# EAGLE design Power Supply (EAGLE 9.6.2)
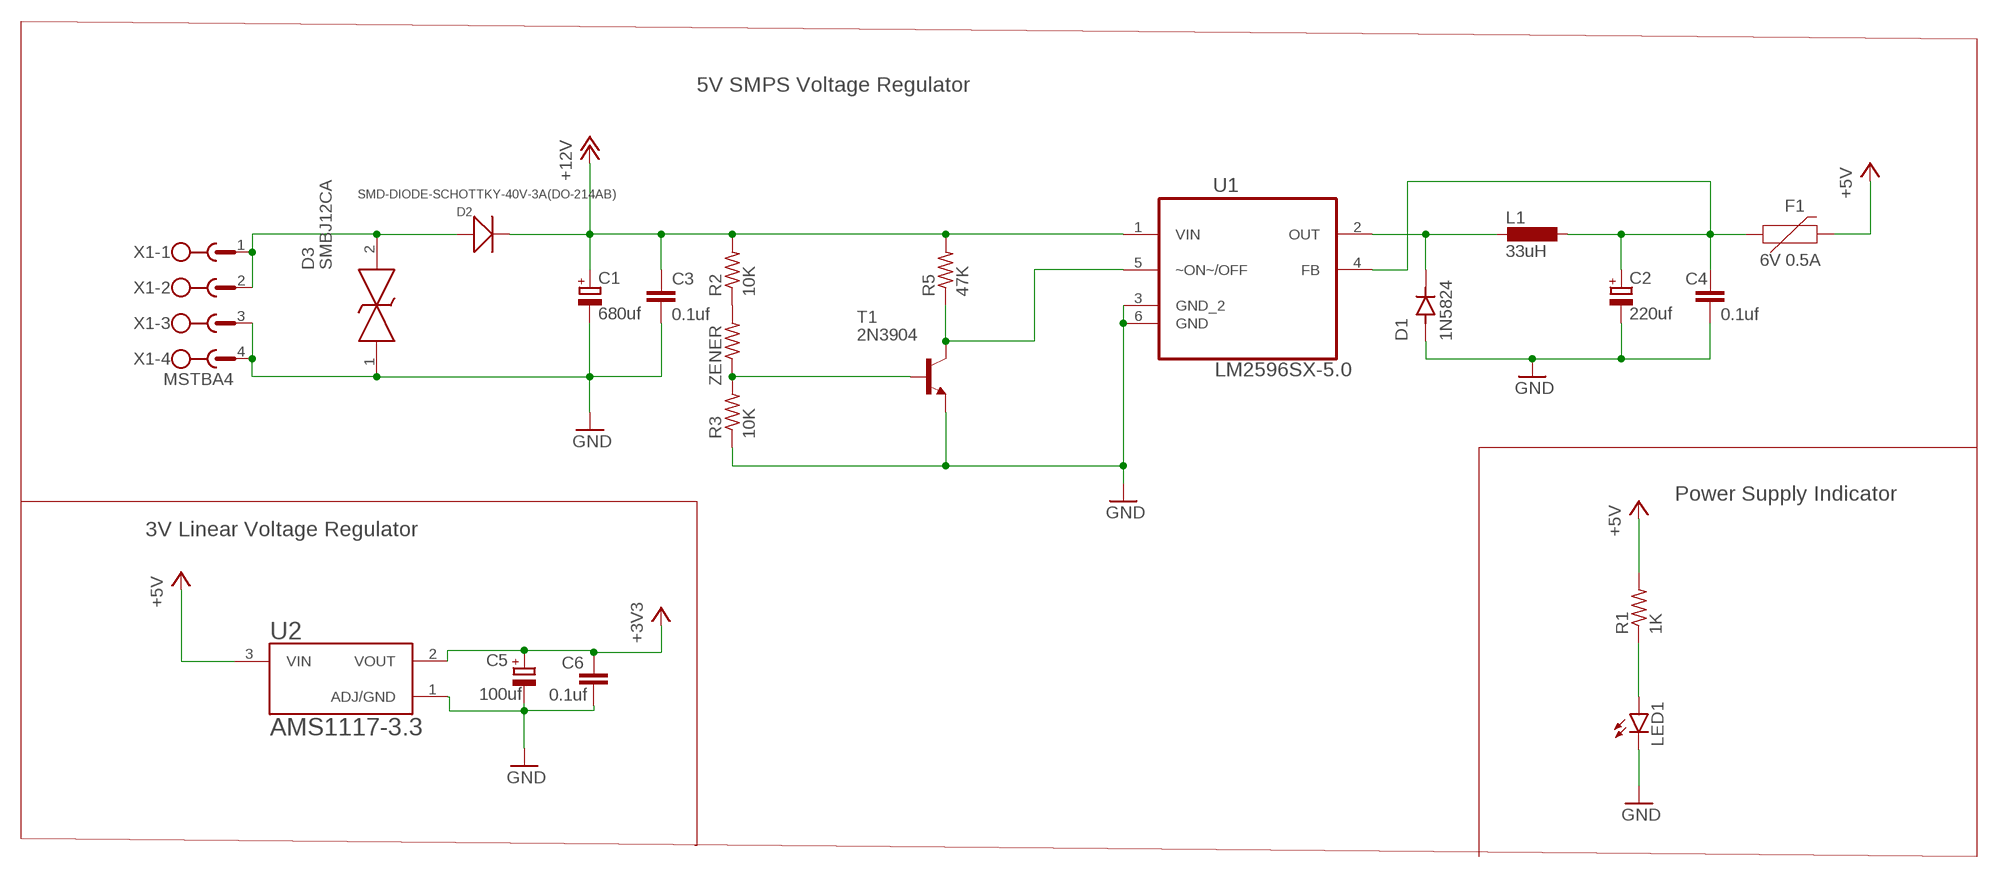
[diagram p0: schematic, sheet 1]

## Parts
C1  680uf  CPOL-EUSMCB  [SMC_B]
C2  220uf  CPOL-EUSMCB  [SMC_B]
C3  0.1uf  C-EUC0805  [C0805]
C4  0.1uf  C-EUC0805  [C0805]
C5  100uf  CPOL-EUSMCB  [SMC_B]
C6  0.1uf  C-EUC0805  [C0805]
D1  1N5824  [DIOAD1898W129L762D1143]
D2  SMD-DIODE-SCHOTTKY-40V-3A(DO-214AB)  [DO-214AB]
D3  SMBJ12CA  [DIONM5443X244N]
F1  6V 0.5A  PPTC_6V500MA  [0805]
L1  33uH  L-EUL1812  [L1812]
LED1  LED3MM  [LED3MM]
R1  1K  R-US_R0805  [R0805]
R2  10K  R-US_R0805  [R0805]
R3  10K  R-US_R0805  [R0805]
R5  47K  R-US_0204/7  [0204/7]
T1  2N3904  [TO92]
U1  LM2596SX-5.0  [TO170P1435X465-6N]
U2  AMS1117-3.3  [SOT229P700X180-4N]
X1  MSTBA4  [MSTBA4]
ZENER  R-US_0204/7  [0204/7]

## Nets
+3V3: C5.+ C6.1 U2.2(VOUT)
+5V: F1.2 R1.2 U2.3(VIN)
+12V: C1.+ C3.1 D2.2(-) R2.2 R5.2 U1.1(VIN)
GND: C1.- C2.- C3.2 C4.2 C5.- C6.2 D1.A D3.1 LED1.K(C) R3.1 T1.3(E) U1.3(GND_2) U1.6(GND) U2.1(ADJ/GND) X1.3 X1.4
N$1: D1.C(K) L1.2 U1.2(OUT)
N$2: LED1.A R1.1
N$3: D2.1(+) D3.2 X1.1 X1.2
N$4: R2.1 ZENER.2
N$5: R3.2 T1.2(B) ZENER.1
N$6: R5.1 T1.1(C) U1.5(~ON~/OFF)
N$7: C2.+ C4.1 F1.1 L1.1 U1.4(FB)

## Notes on the sheet
- 5V SMPS Voltage Regulator
- Power Supply Indicator
- 3V Linear Voltage Regulator

## Library data of the parts
C1 C2 C5 = rcl:CPOL-EU: POLARIZED CAPACITOR, European symbol; SPICEPREFIX: C
C3 C4 C6 = rcl:C-EU: CAPACITOR, European symbol; SPICEPREFIX: C
D1 = 1N5824:1N5824: 1N5824 Check prices <https://pricing.snapeda.com/parts/1N5824/Microchip%20Technology/view-part?ref=eda>; AVAILABILITY: Bad; DESCRIPTION: Diode Schottky 30V 5A Through Hole Axial; MF: Microchip Technology; MP: 1N5824; PACKAGE: None; PRICE: None
D2 = PC_Diode_SS34:SMD-DIODE-SCHOTTKY-40V-3A(DO-214AB): 304020018; AVAILABILITY: Unavailable; DESCRIPTION: Rectifier, Schottky; DO-214AB; 3.0A IF; 0.75V; 40V; 100A IFRM; 10000V/us; 1000pF; MF: Vishay; MP: SS34-E3/57T; PACKAGE: DO-214 Vishay; PRICE: None
D3 = PC_Diode_SMBJ12CA:SMBJ12CA: BOURNS - SMBJ12CA - TVS DIODE, 600W, 12V, BIDIR, DO-214AA Source: Datasheet <https://www.mouser.com/ds/2/54/mbj-778392.pdf>; DESCRIPTION: BOURNS - SMBJ12CA - TVS DIODE, 600W, 12V, BIDIR, DO-214AA; HEIGHT: 2.44mm; MANUFACTURER_NAME: Bourns; MANUFACTURER_PART_NUMBER: SMBJ12CA; MOUSER_PART_NUMBER: 652-SMBJ12CA; MOUSER_PRICE-STOCK: https://www.mouser.com/Search/Refine.aspx?Keyword=652-SMBJ12CA
F1 = SparkFun-Fuses:PPTC: Resettable Fuse PPTC Resettable Fuse. Really a sort of resistor with a polymeric positive temperature coefficient whose resistance increases dramatically with an increase in temperature. When heated by the power passing through the resistance rises causing the current to be limited, protecting the circuit. This is achieved by the transition of the polymer from a crystalline to an amorphous state where the conductive carbon separates breaking the conductive pathways found in the cool crystalline structure. When a PPTC cools back down it resumes conducting letting the circuit turn back on. SparkFun Products: SparkFun RedBoard - Programmed with Arduino <https://www.sparkfun.com/products/12757> Pro Micro - 5V/16MHz <https://www.sparkfun.com/products/12640> Arduino Pro 328 - 5V/16MHz <https://www.sparkfun.com/products/10915> MP3 Trigger <https://www.sparkfun.com/products/13720>; PROD_ID: RES-13945
L1 = rcl:L-EU: INDUCTOR, European symbol; SPICEPREFIX: L
LED1 = led:LED: LED OSRAM: - CHIPLED LG R971, LG N971, LY N971, LG Q971, LY Q971, LO R971, LY R971 LH N974, LH R974 LS Q976, LO Q976, LY Q976 LO Q996 - Hyper CHIPLED LW Q18S LB Q993, LB Q99A, LB R99A - SideLED LS A670, LO A670, LY A670, LG A670, LP A670 LB A673, LV A673, LT A673, LW A673 LH A674 LY A675 LS A676, LA A676, LO A676, LY A676, LW A676 LS A679, LY A679, LG A679 - Hyper Micro SIDELED® LS Y876, LA Y876, LO Y876, LY Y876 LT Y87S - SmartLED LW L88C, LW L88S LB L89C, LB L89S, LG L890 LS L89K, LO L89K, LY L89K LS L896, LA L896, LO L896, LY L896 - TOPLED LS T670, LO T670, LY T670, LG T670, LP T670 LSG T670, LSP T670, LSY T670, LOP T670, LYG T670 LG T671, LOG T671, LSG T671 LB T673, LV T673, LT T673, LW T673 LH T674 LS T676, LA T676, LO T676, LY T676, LB T676, LH T676, LSB T676, LW T676 LB T67C, LV T67C, LT T67C, LS T67K, LO T67K, LY T67K, LW E67C LS E67B, LA E67B, LO E67B, LY E67B, LB E67C, LV E67C, LT E67C LW T67C LS T679, LY T679, LG T679 LS T770, LO T770, LY T770, LG T770, LP T770 LB T773, LV T773, LT T773, LW T773 LH T774 LS E675, LA E675, LY E675, LS T675 LS T776, LA T776, LO T776, LY T776, LB T776 LHGB T686 LT T68C, LB T68C - Hyper Mini TOPLED® LB M676 - Mini TOPLED Santana® LG M470 LS M47K, LO M47K, LY M47K Source: http://www.osram.convergy.de LUXEON: - LUMILED® LXK2-PW12-R00, LXK2-PW12-S00, LXK2-PW14-U00, LXK2-PW14-V00 LXK2-PM12-R00, LXK2-PM12-S00, LXK2-PM14-U00 LXK2-PE12-Q00, LXK2-PE12-R00, LXK2-PE12-S00, LXK2-PE14-T00, LXK2-PE14-U00 LXK2-PB12-K00, LXK2-PB12-L00, LXK2-PB12-M00, LXK2-PB14-N00, LXK2-PB14-P00, LXK2-PB14-Q00 LXK2-PR12-L00, LXK2-PR12-M00, LXK2-PR14-Q00, LXK2-PR14-R00 LXK2-PD12-Q00, LXK2-PD12-R00, LXK2-PD12-S00 LXK2-PH12-R00, LXK2-PH12-S00 LXK2-PL12-P00, LXK2-PL12-Q00, LXK2-PL12-R00 Source: www.luxeon.com KINGBRIGHT: KA-3528ASYC Source: www.kingbright.com
R1-R3 R5 ZENER = rcl:R-US_: RESISTOR, American symbol; SPICEPREFIX: R
T1 = transistor:2N3904: NPN TRANSISTOR
U1 = PC_SMPS_LM2596S-5.0:LM2596SX-5.0: Voltage Regulator; AVAILABILITY: Unavailable; DESCRIPTION: Ic, Step-Down Volt Regulator 5v To-220-5, Full Reel; MF: Texas Instruments; MP: LM2596SX-5.0; PACKAGE: TO-263-5 Texas Instruments; PRICE: None
U2 = PC_Regulator_AMS1117-3.3:AMS1117-3.3: Sot223/Pkg 1-Amp 3.3-Volt Low Drop Out Voltage Regulatator; AVAILABILITY: Unavailable; DESCRIPTION: Sot223/Pkg 1-Amp 3.3-Volt Low Drop Out Voltage Regulatator; MF: Advanced Monolithic Systems; MP: AMS1117-3.3; PACKAGE: None; PRICE: None
X1 = con-phoenix-508:MSTBA4: PHOENIX; MF: FARNELL; MPN: 1757268; OC_FARNELL: 3705195; OC_NEWARK: 71C4163

## Board
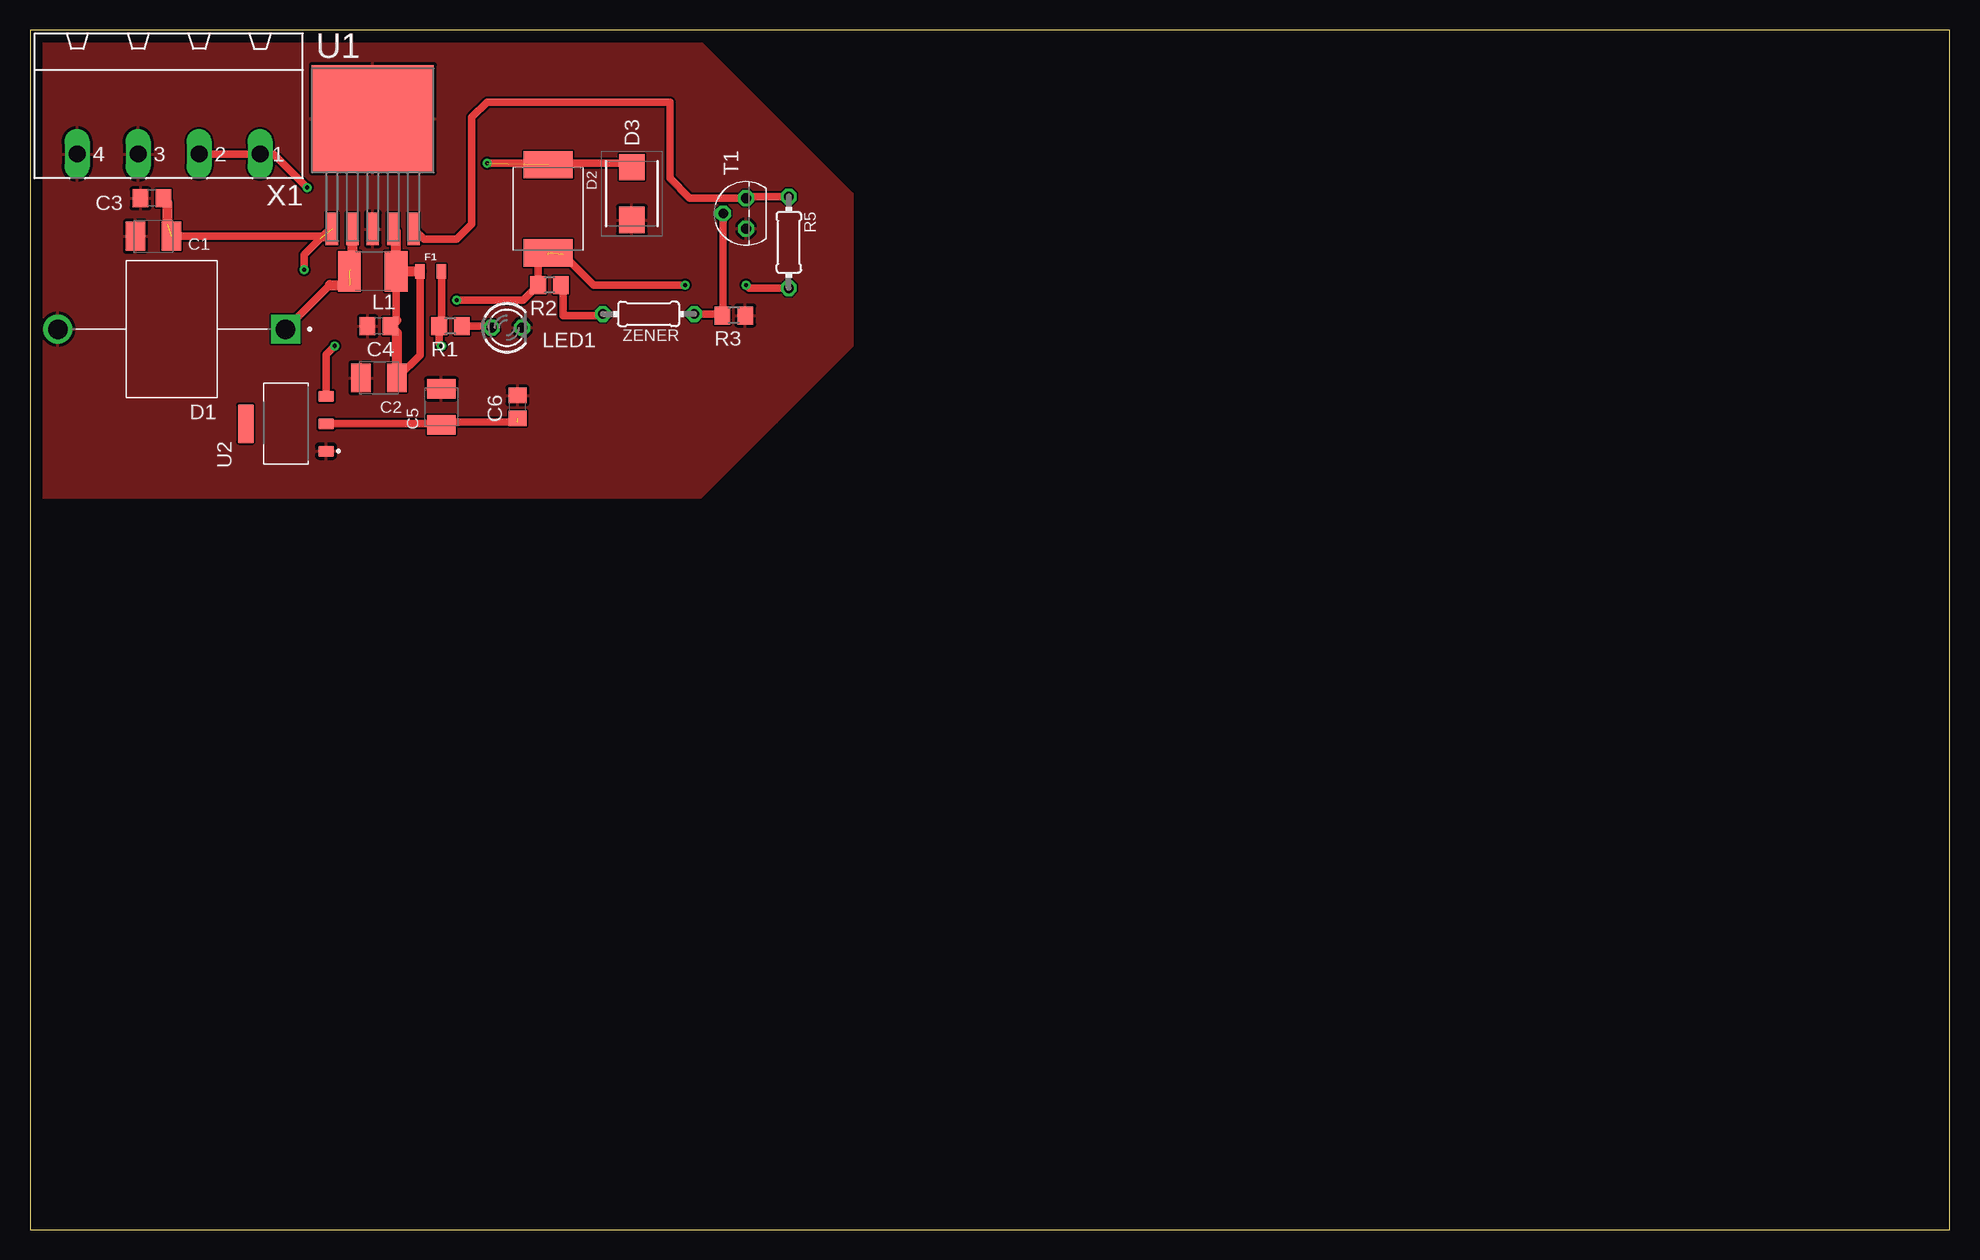
[diagram p1: board, top side]
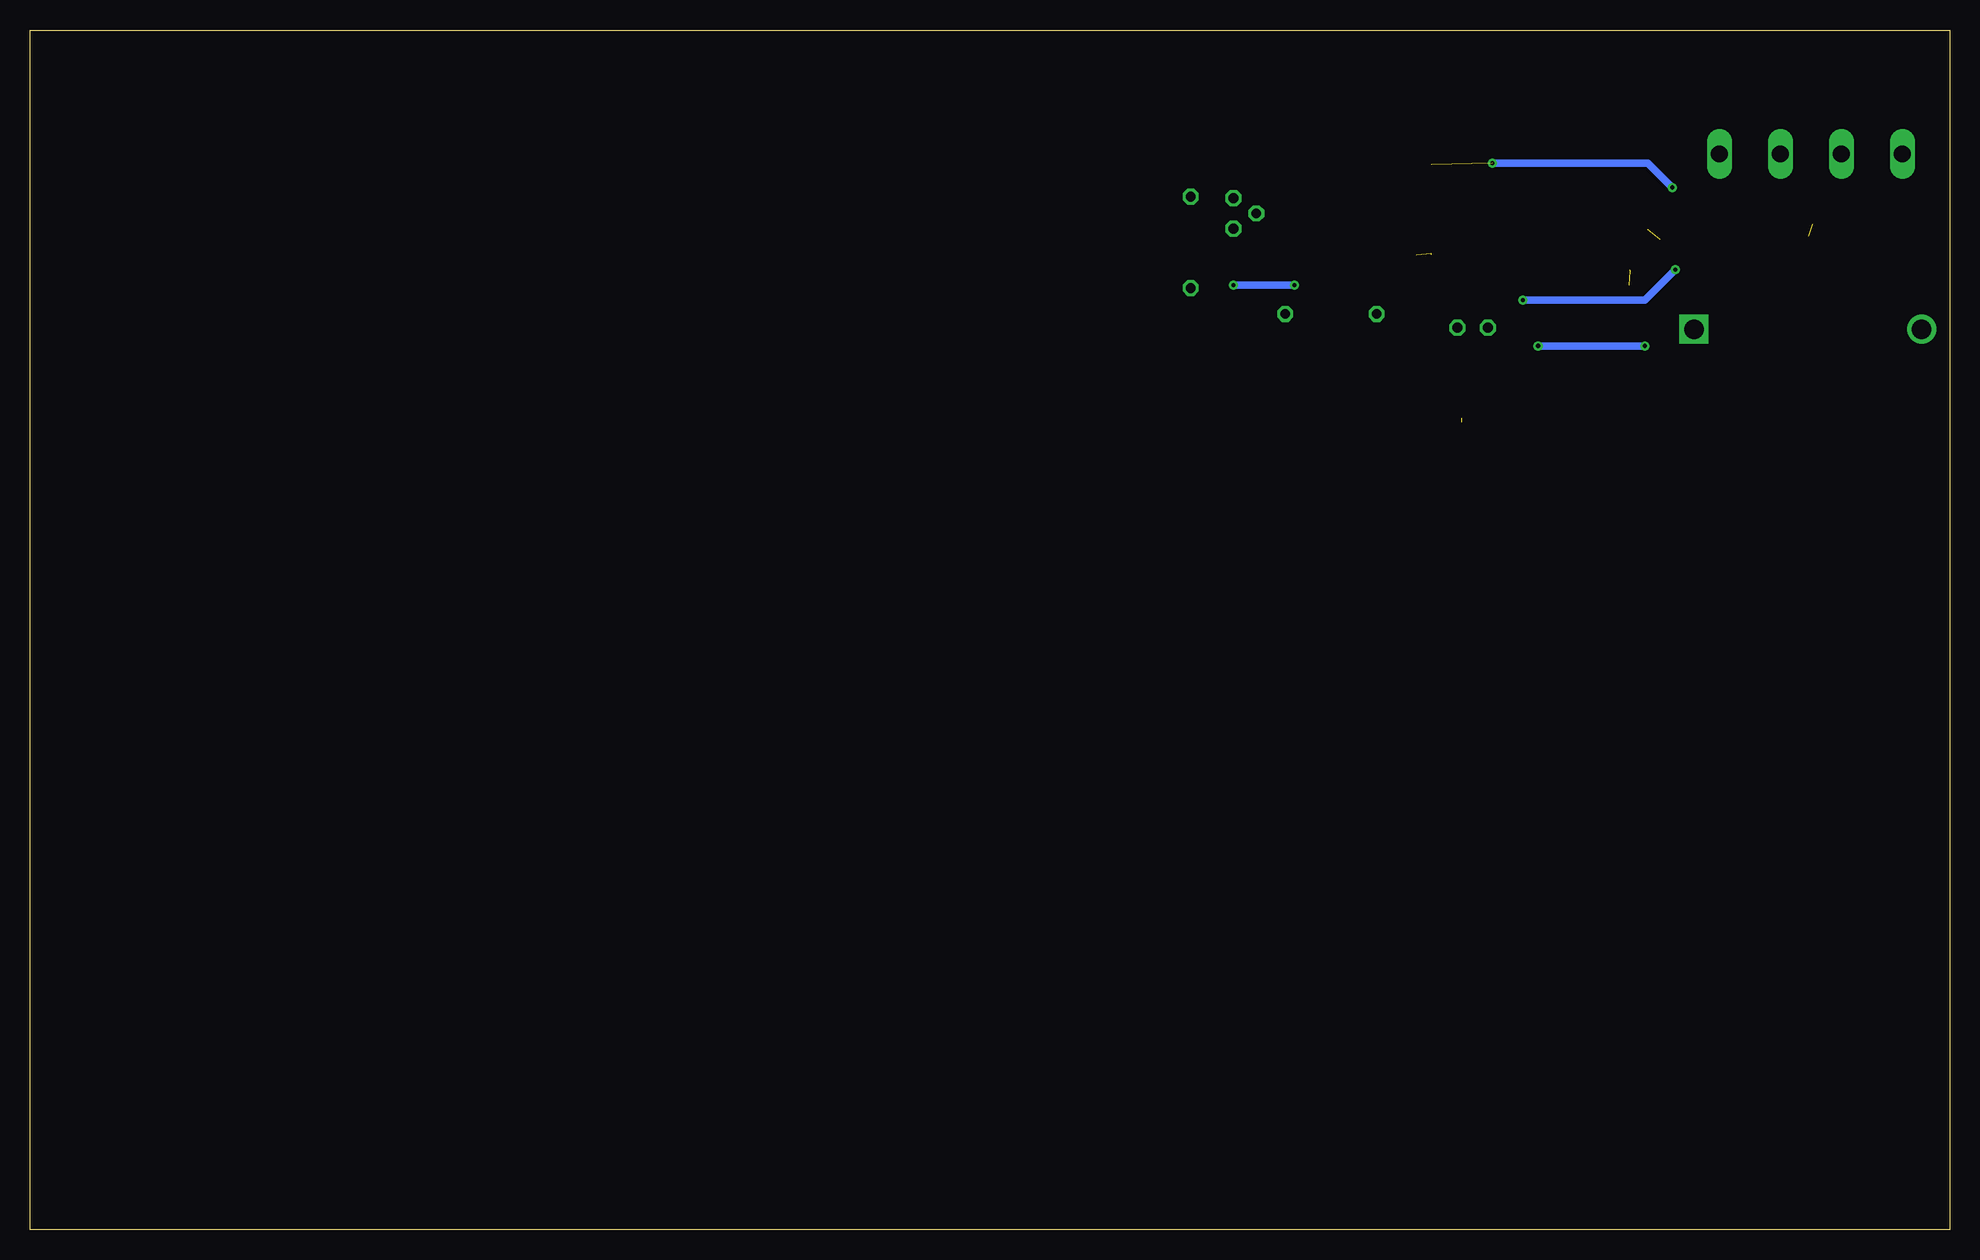
[diagram p2: board, bottom side, seen from below]

Size 160 x 100 mm. Coordinates in mm from the lower left corner, seen from the top.
Outline: 0,0 160,0 160,100 0,100 0,0
Copper layers (1*16): Top 0.035mm / dielectric 1.5mm / Bottom 0.035mm
Design rules "default": minimum track width 6mil, minimum drill 0.35mm, track to track 6mil, track to pad 6mil, pad to pad 6mil, via to via 6mil, smd to smd 6mil, copper to edge 40mil, drill to drill 6mil, minimum pad ring 10mil, minimum via ring 8mil, stop-mask expansion 4mil, vias tented up to drill 0mil, thermal gap 10mil

### Footprints (pad centres in the part's own frame; a part is rotated, then mirrored left to right if it is on the bottom)
SMC_B = smd 1.6 x 2.4: + -1.5,0; - 1.5,0
C0805 = smd 1.3 x 1.5: 1 -0.95,0; 2 0.95,0
DIOAD1898W129L762D1143 = drill 1.62 pad 2.43: A 9.49,0 | drill 1.62 pad 2.43 square: C -9.49,0
DO-214AB = smd 2.286 x 4.064: 1 -3.683,0; 2 3.683,0
DIONM5443X244N = smd 2.2 x 2.15: 1 -2.2,0; 2 2.2,0
0805 = smd 0.8 x 1.2: 1 -0.9,0; 2 0.9,0
L1812 = smd 1.9 x 3.4: 1 -1.95,0; 2 1.95,0
LED3MM = drill 0.813 octagon: A -1.27,0; K 1.27,0
R0805 = smd 1.3 x 1.5: 1 -0.95,0; 2 0.95,0
0204/7 = drill 0.813 octagon: 1 -3.81,0; 2 3.81,0
TO92 = drill 0.813 octagon: 1 1.27,0; 2 0,1.905; 3 -1.27,0
TO170P1435X465-6N = smd 1.016 x 2.692: 1 -3.404,-9.042; 2 -1.702,-9.042; 3 0,-9.042; 4 1.702,-9.042; 5 3.404,-9.042 | smd 10.16 x 8.941: 6 0,0.152
SOT229P700X180-4N = smd 0.93 x 1.31: 1 -2.29,-3.345; 2 0,-3.345; 3 2.29,-3.345 | smd 3.24 x 1.31: 4 0,3.345
MSTBA4 = drill 1.397 long: 1 -7.62,5.08; 2 -2.54,5.08; 3 2.54,5.08; 4 7.62,5.08

### Placement (x,y rotation side)
C1  10.29,82.8 180 top
C2  29.08,70.99 180 top
C3  10.16,85.98 180 top
C4  29.08,75.31 180 top
C5  34.29,68.58 90 top
C6  40.64,68.58 90 top
D1  11.81,75.06 180 top
D2  43.18,85.09 270 top
D3  50.16,86.36 90 top
F1  33.4,79.88 0 top
L1  28.57,79.88 180 top
LED1  39.75,75.18 0 top
R1  35.05,75.31 180 top
R2  43.31,78.74 180 top
R3  58.67,76.2 180 top
R5  63.25,82.3 270 top
T1  59.69,84.71 90 top
U1  28.57,92.46 0 top
U2  21.34,67.18 90 top
X1  11.56,94.74 180 top
ZENER  51.56,76.33 180 top

### Tracks (layer width: path | path; a pad name or v marks a point on that pad's centre or on a via)
+3V3  (1 unrouted)
  Top 0.635: U2.2 34.19,67.18 | 34.52,67.31 40.64,67.31
  Top 0.813: 34.19,67.18 C5.+ 34.52,67.31
+5V  (via drill 0.35)
  Top 0.635: F1.2 34.3,75.51 | U2.3 24.68,72.94 v25.4,73.66 | v34.29,73.66 34.1,73.85 R1.2
  Top 0.813: 34.3,75.51 R1.2
  Bottom 0.635: v25.4,73.66 v34.29,73.66
+12V  (via drill 0.35)  (4 unrouted)
  Top 0.635: C1.+ 24.56,82.8 | R5.2 59.94,78.49 v59.69,78.74 | v54.61,78.74 46.99,78.74 44.45,81.28 | 43.18,81.28 42.36,80.46 R2.2 41.09,77.47 v35.56,77.47 | v22.86,80.01 22.86,81.28 24.13,82.55
  Top 0.813: C3.1 11.43,85.66 11.43,83.82 | 24.56,82.8 U1.1
  Bottom 0.635: v59.69,78.74 v54.61,78.74 | v35.56,77.47 25.4,77.47 v22.86,80.01
GND
  pour Top: 0,100.33 54.61,100.33 68.58,86.36 68.58,73.66 62.23,67.31 55.88,60.96 0,60.96
N$1  (2 unrouted)
  Top 0.635: D1.C 24.98,78.74
  Top 0.813: U1.2 26.87,80.21 26.67,80.01 | 24.98,78.74 26.67,78.74
N$2
  Top 0.635: R1.1 38.35,75.31 LED1.A
N$3  (via drill 0.35)  (1 unrouted)
  Top 0.635: X1.2 X1.1 20.32,89.66 v23.11,86.87 | D3.2 49.83,88.9 v38.1,88.9
  Bottom 0.635: v38.1,88.9 25.15,88.9 v23.11,86.87
N$4
  Top 0.635: R2.1 44.45,78.55 44.45,76.2 47.62,76.2 ZENER.2
N$5
  Top 0.635: T1.2 57.78,76.26 R3.2 57.6,76.33 ZENER.1
N$6
  Top 0.635: R5.1 59.82,86.11 T1.1 54.99,85.98 53.34,87.63 53.34,93.98 38.1,93.98 36.83,92.71 36.83,83.82 35.56,82.55 32.84,82.55 U1.5
N$7
  Top 0.635: L1.1 30.52,75.8 | C2.+ 32.5,72.91 F1.1
  Top 0.813: U1.4 30.48,83.21 30.48,80.01 30.61,79.88 F1.1 | C2.+ 30.58,74.76 C4.1 30.52,75.8